# Altium schematic sheet COVER PAGE.SchDoc
size A3; SheetNumber: 2; SheetTotal: 13
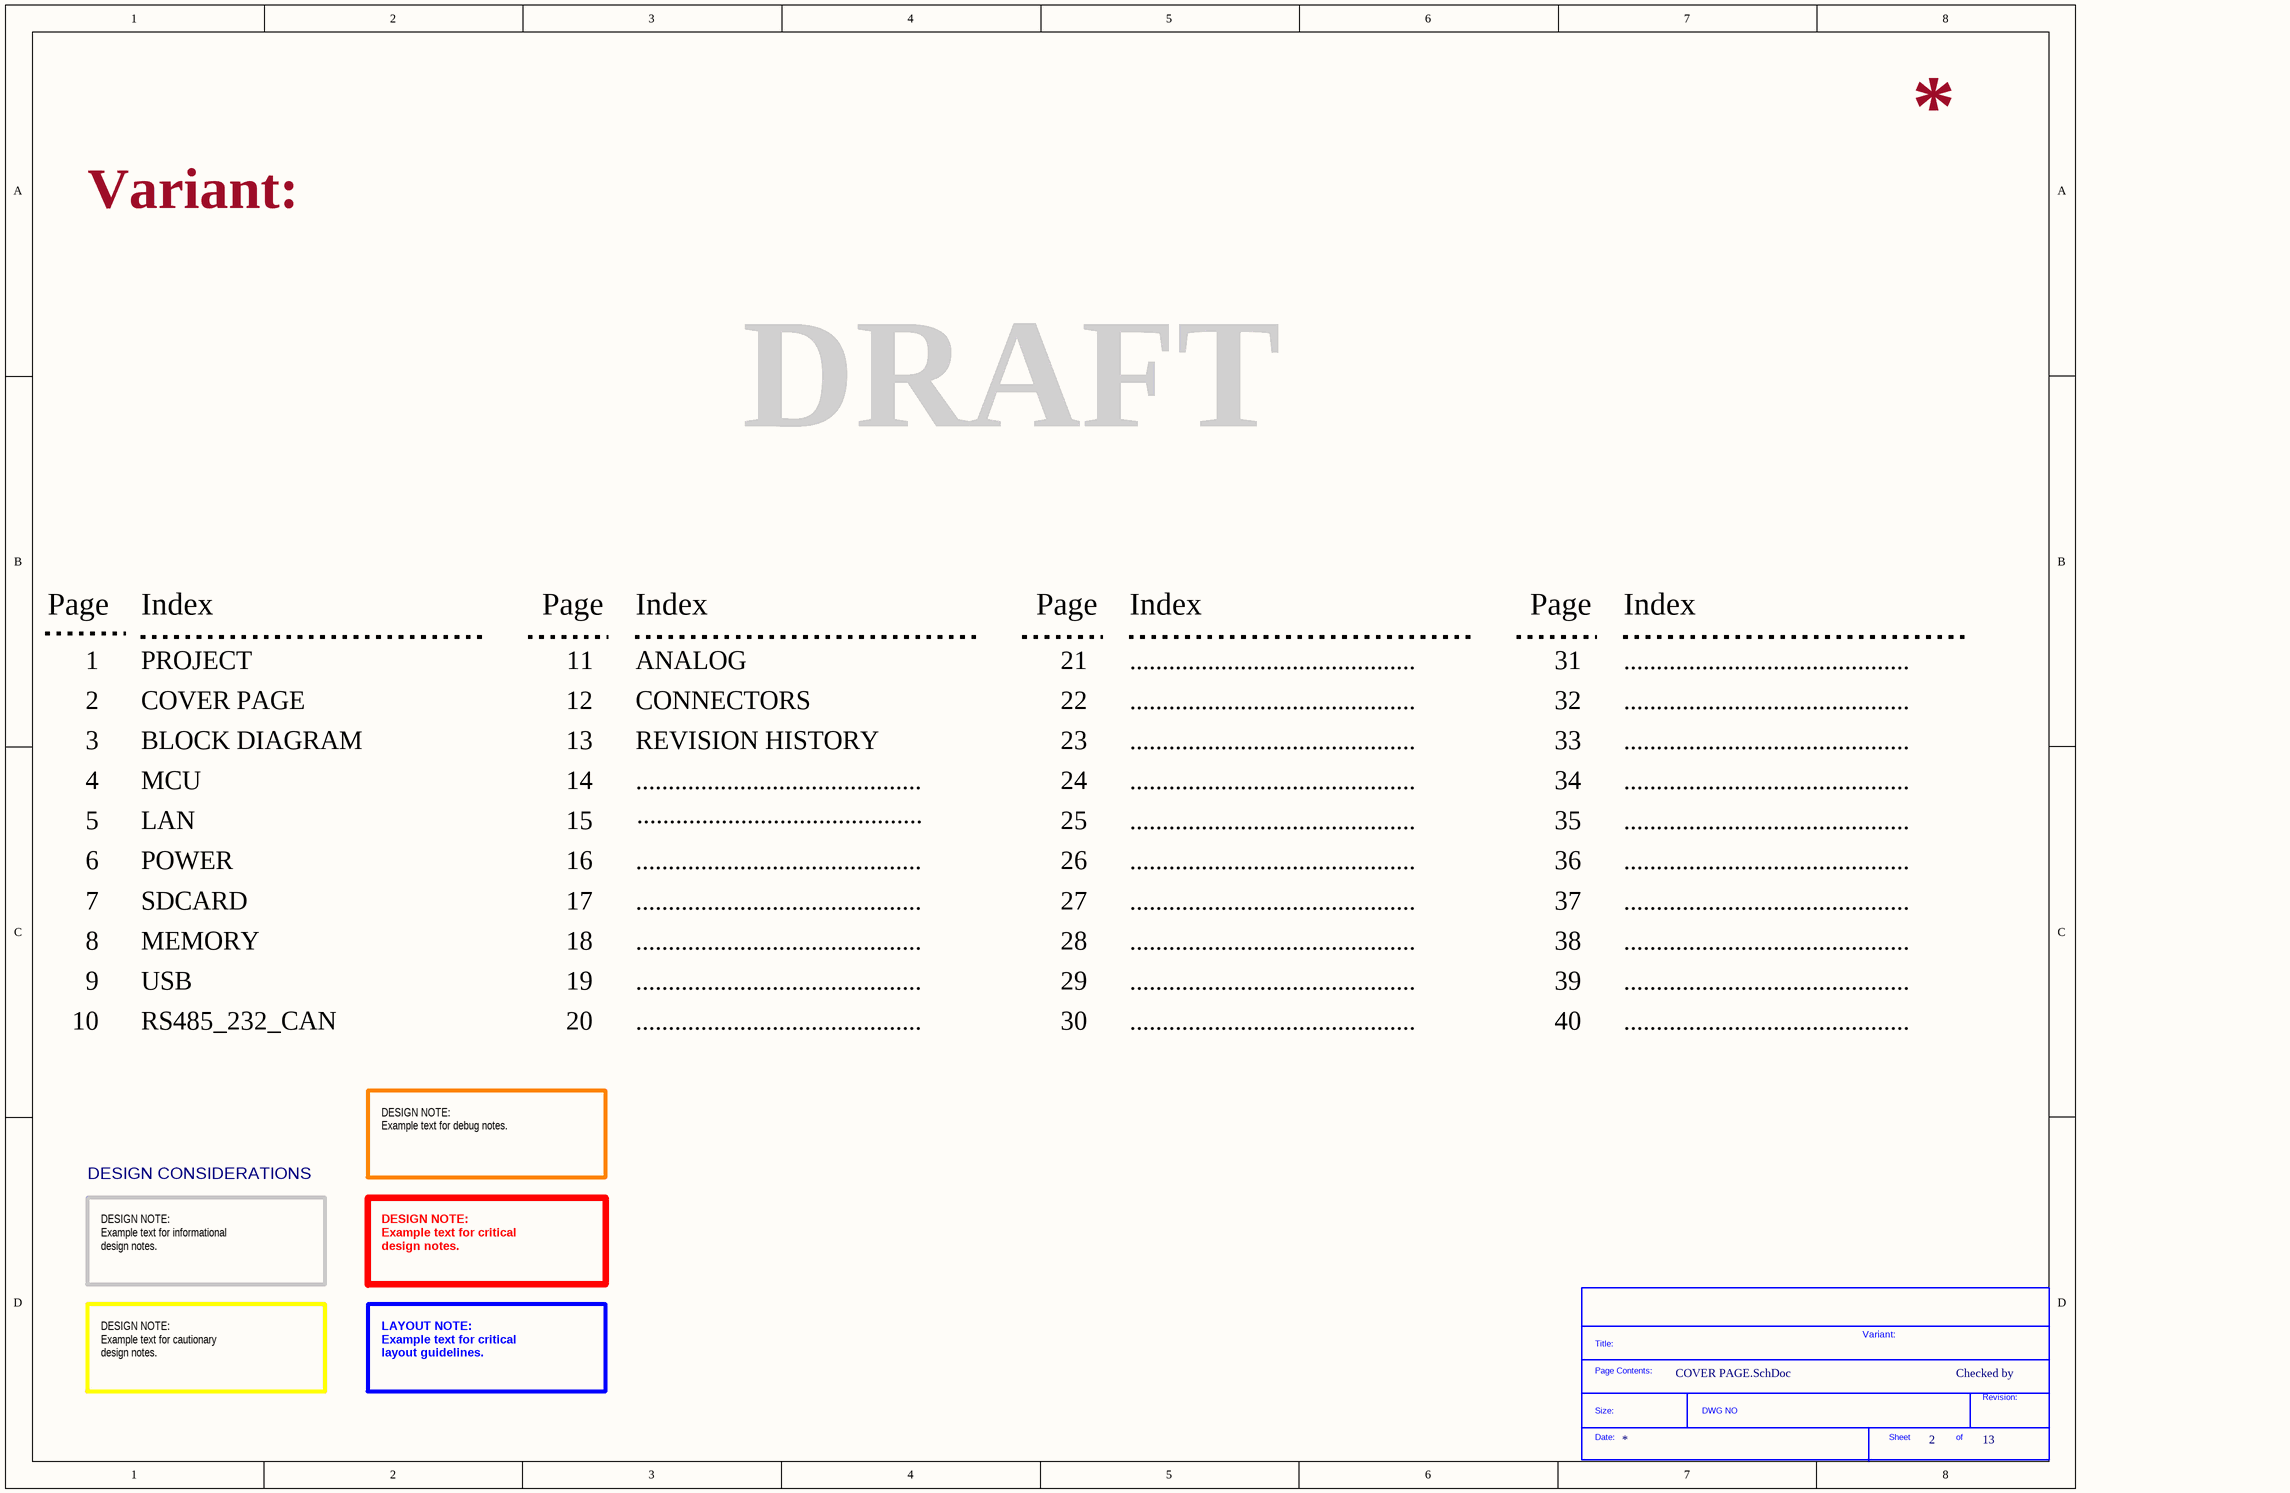
[diagram p0: COVER PAGE.SchDoc]

## Parts
*?  SDTitleBlock  (value not drawn)  (graphical)

## Notes on the sheet
- Variant:
- DRAFT
- Page
- Index
- 1
- 2
- PROJECT
- COVER PAGE
- 11
- 12
- ANALOG
- CONNECTORS
- 21
- 22
- ............................................
- 31
- 32
- 3
- BLOCK DIAGRAM
- 13
- REVISION HISTORY
- 23
- 33
- 4
- 5
- MCU
- LAN
- 14
- 15
- 24
- 25
- 34
- 35
- 6
- 7
- POWER
- SDCARD
- 16
- 17
- 26
- 27
- 36
- 37
- 8
- MEMORY
- 18
- 28
- 38
- 9
- 10
- USB
- RS485_232_CAN
- 19
- 20
- 29
- 30
- 39
- 40
- DESIGN CONSIDERATIONS
- DESIGN NOTE:
  Example text for debug notes.
- DESIGN NOTE:
  Example text for informational
  design notes.
- DESIGN NOTE:
  Example text for critical
  design notes.
- DESIGN NOTE:
  Example text for cautionary
  design notes.
- LAYOUT NOTE:
  Example text for critical
  layout guidelines.
- Checked by
- (in symbol SDTitleBlock) Title:; Page Contents:; Revision:; Size:; DWG NO; Date:; Sheet; of